# EAGLE schematic powerStageC_rev3 (EAGLE 7.1.0)
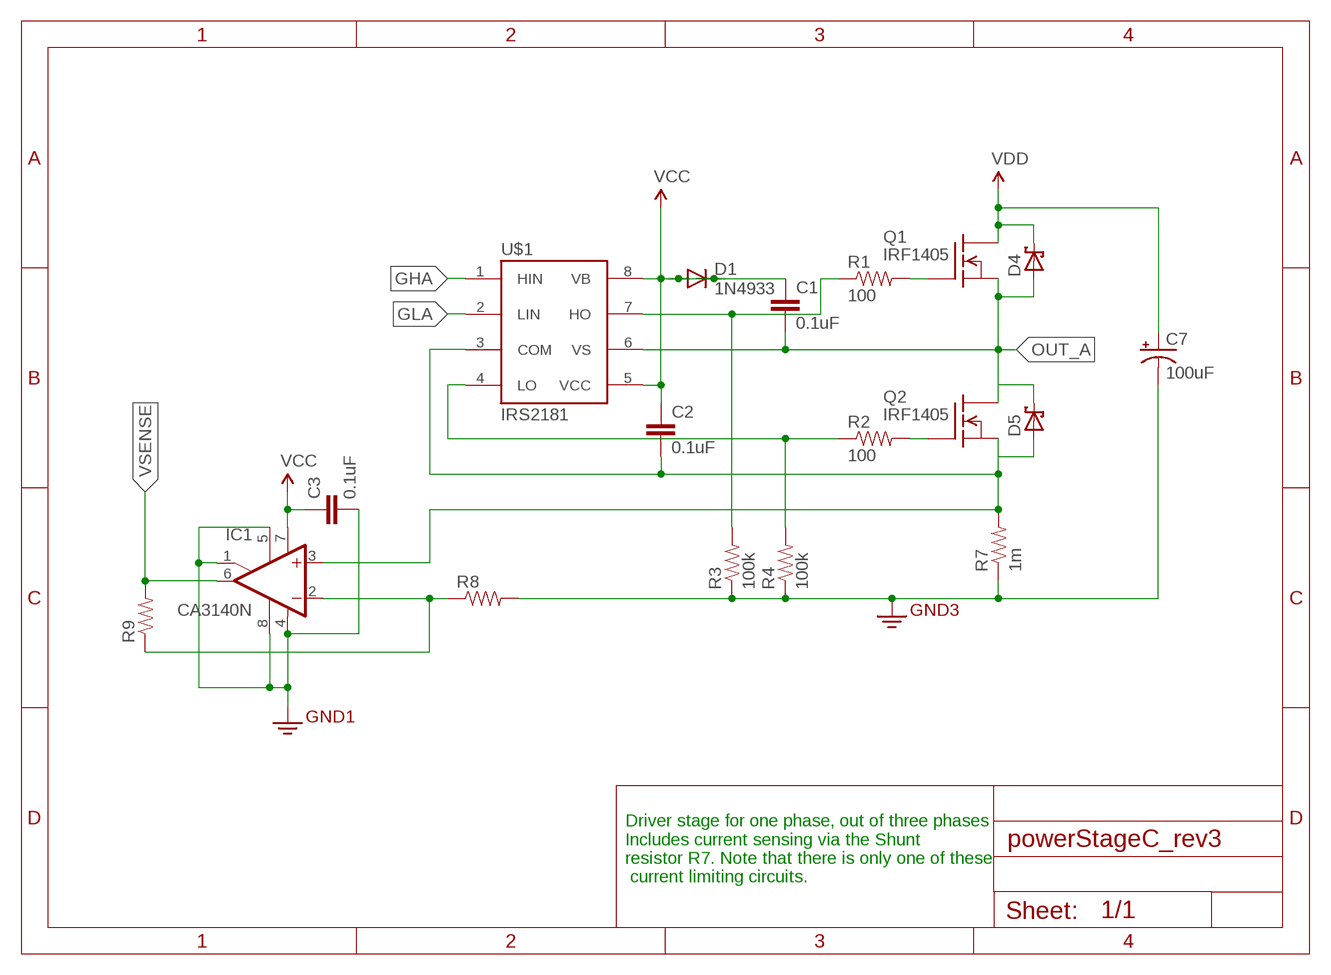
[diagram p0: schematic, sheet 1]

## Parts
C1  0.1uF  0.1UF-25V(+80/-20%)(0603)  [0603-CAP]
C2  0.1uF  0.1UF-25V(+80/-20%)(0603)  [0603-CAP]
C3  0.1uF  0.1UF-25V(+80/-20%)(0603)  [0603-CAP]
C7  100uF  100UF-63V-20%(ELECT)  [PANASONIC_H13]
D1  1N4933  [DO41-10]
D4  SCHOTTKY-DIODEDO41  [DO41-10]
D5  SCHOTTKY-DIODEDO41  [DO41-10]
IC1  CA3140N  [DIL08]
Q1  IRF1405  IRF540  [TO220]
Q2  IRF1405  IRF540  [TO220]
R1  100  RESISTORAXIAL-0.3  [AXIAL-0.3]
R2  100  RESISTORAXIAL-0.3  [AXIAL-0.3]
R3  100k  RESISTORAXIAL-0.3  [AXIAL-0.3]
R4  100k  RESISTORAXIAL-0.3  [AXIAL-0.3]
R7  1m  RESISTORPTH-2W  [AXIAL-0.8]
R8  RESISTORAXIAL-0.3  [AXIAL-0.3]
R9  RESISTORAXIAL-0.3  [AXIAL-0.3]
U$1  IRS2181  [DIP08]

## Nets
3.3V: C3.2 C7.- IC1.1(ON/CMP) IC1.4(V-) IC1.5(ON) IC1.8(CMP) R3.P$1 R4.P$1 R7.P$1 R8.P$2 ; supply symbol labelled GND2
GHA: U$1.1(HIN)
GLA: U$1.2(LIN)
N$1: R1.P$1 R3.P$2 U$1.7(HO)
N$2: Q1.1(G) R1.P$2
N$3: R2.P$1 R4.P$2 U$1.4(LO)
N$4: Q2.1(G) R2.P$2
N$8: C2.2 IC1.3(+IN) Q2.3(S) R7.P$2 U$1.3(COM)
N$10: IC1.2(-IN) R8.P$1 R9.P$1
OUT_A: C1.2 D4.A Q1.3(S) Q2.2(D) U$1.6(VS)
OUT_A1: D5.A
VCC: C1.1 C2.1 C3.1 D1.A D1.C IC1.7(V+) U$1.5(VCC) U$1.8(VB)
VDD: C7.+ D4.C Q1.2(D)
VDD1: D5.C
VSENSE: IC1.6(OUT) R9.P$2

## Notes on the sheet
- Driver stage for one phase, out of three phases
  Includes current sensing via the Shunt 
  resistor R7. Note that there is only one of these
   current limiting circuits.

## Library data of the parts
C1-C3 = SparkFun-Capacitors:0.1UF-25V(+80/-20%)(0603): CAP-00810 Ceramic Standard decoupling cap; PROD_ID: CAP-00810
C7 = SparkFun-Capacitors:100UF-63V-20%(ELECT): CAP-08362 100uF electrolytic SMT 63V 20%; PROD_ID: CAP-08362
D1 = diode:1N4933: DIODE fast recovery rectifier, 1A
D4 D5 = adafruit:SCHOTTKY-DIODE: Schottky Diode
IC1 = linear:CA3140: OP AMP
Q1 Q2 = transistor-fet:IRF540: N-Channel Enhancement MOSFET (HEXFET); 100V; 28A; 0,077Ohm
R1-R4 R8 R9 = SparkFun-Resistors:RESISTOR: Resistor Basic schematic elements and footprints for 0603, 1206, and PTH resistors.
R7 = SparkFun-Passives:RESISTOR: Resistor Basic schematic elements and footprints for 0603, 1206, and PTH resistors.
U$1 = Jamie:IRS2181